# EAGLE design XBee SMT Spring Pin THT Adapter (EAGLE 7.5.0)
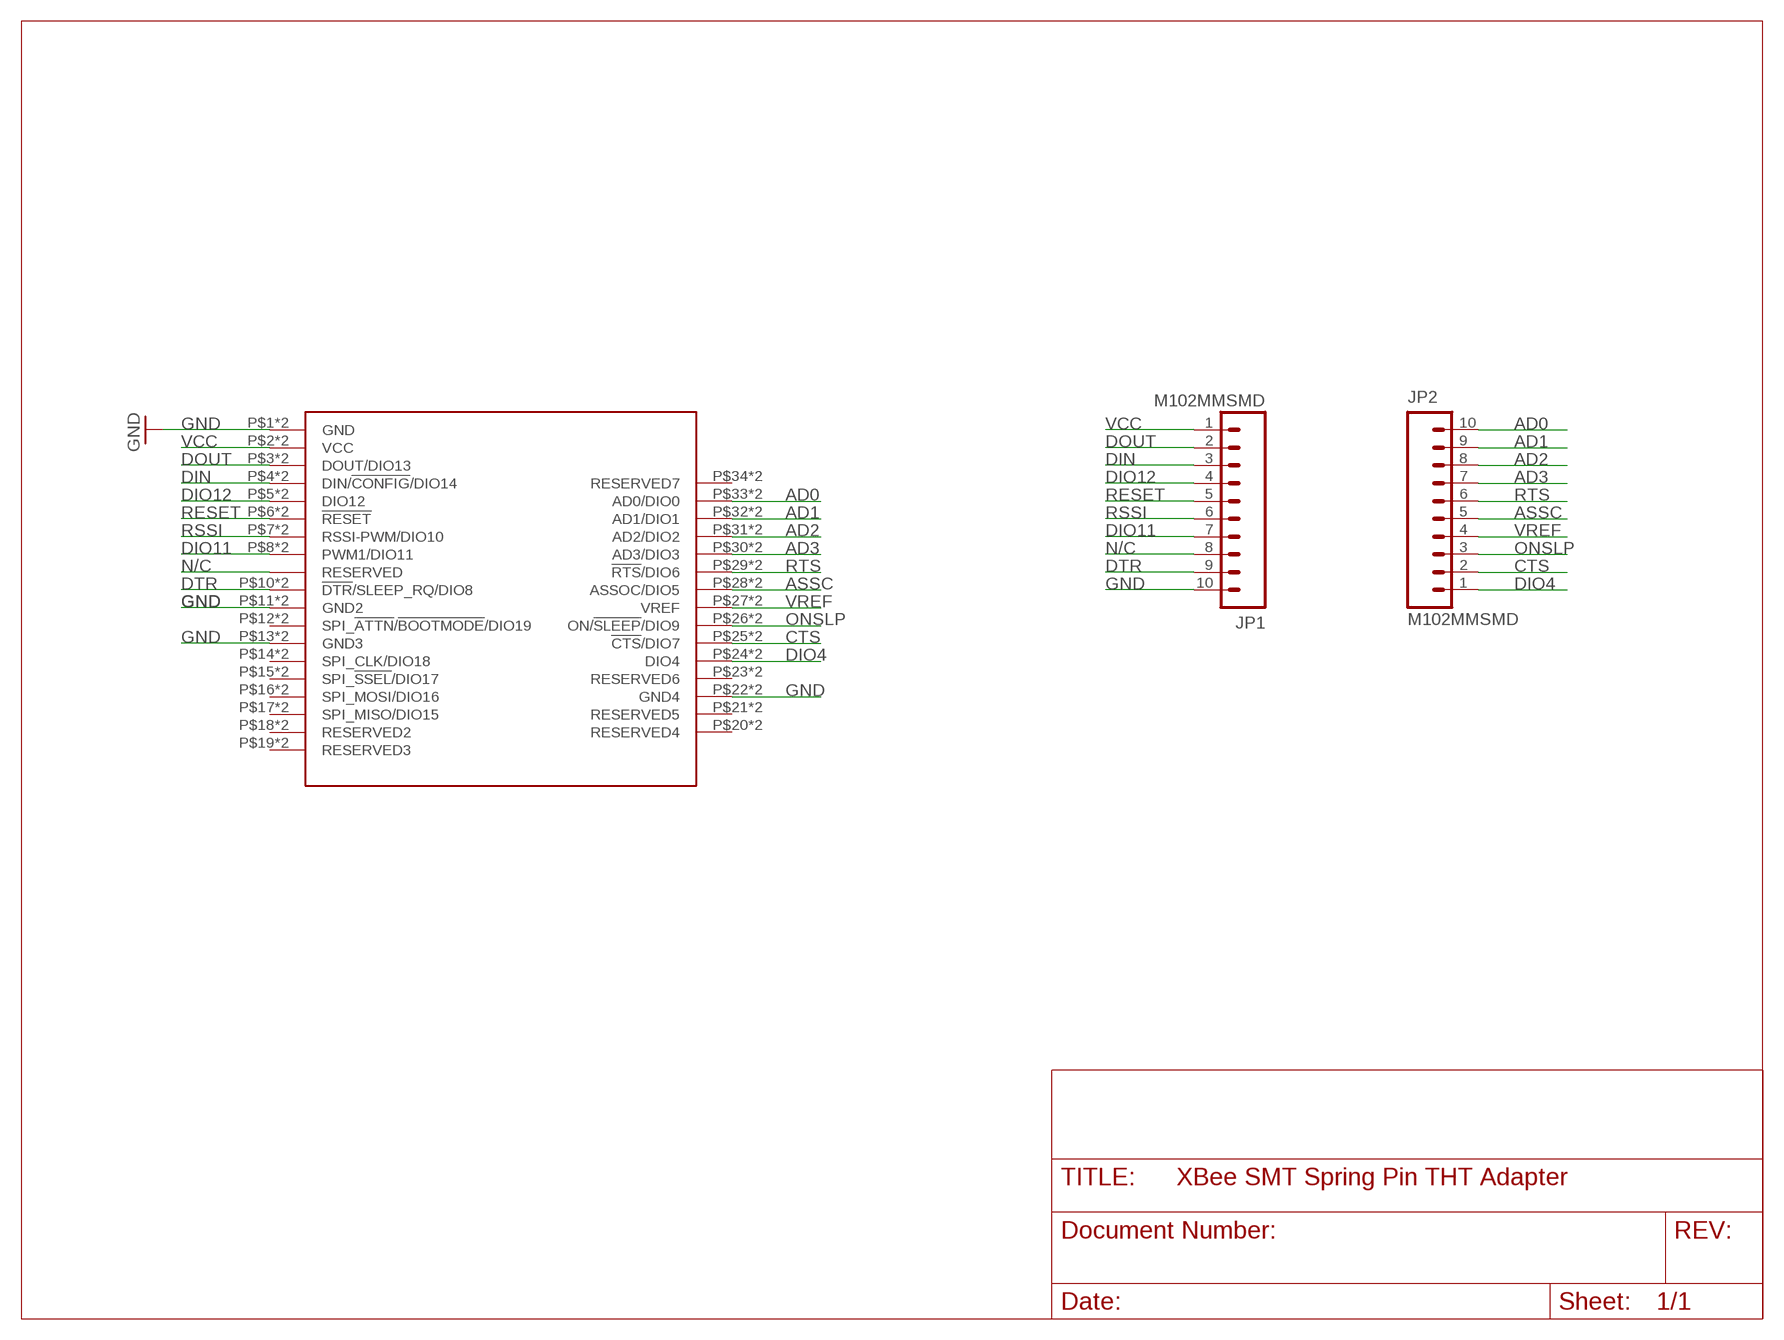
[diagram p0: schematic, sheet 1]

## Parts
JP1  M102MMSMD  [1X10-2MM-SMD]
JP2  M102MMSMD  [1X10-2MM-SMD]
U$2  XBEE-SMT  XBEE_SMT_SPRING_SOCKETSMALL_HOLE  [XBEE_SMT_SPRING_SOCKET_SMALL_HOLE_76002056]

## Nets
AD0: JP2.10 U$2.P$33(AD0/DIO0) U$2.P$330(AD0/DIO0)
AD1: JP2.9 U$2.P$32(AD1/DIO1) U$2.P$320(AD1/DIO1)
AD2: JP2.8 U$2.P$31(AD2/DIO2) U$2.P$310(AD2/DIO2)
AD3: JP2.7 U$2.P$30(AD3/DIO3) U$2.P$300(AD3/DIO3)
ASSC: JP2.5 U$2.P$28(ASSOC/DIO5) U$2.P$280(ASSOC/DIO5)
CTS: JP2.2 U$2.P$25(!CTS!/DIO7) U$2.P$250(!CTS!/DIO7)
DIN: JP1.3 U$2.P$4(DIN/!CONFIG!/DIO14) U$2.P$040(DIN/!CONFIG!/DIO14)
DIO4: JP2.1 U$2.P$24(DIO4) U$2.P$240(DIO4)
DIO11: JP1.7 U$2.P$8(PWM1/DIO11) U$2.P$080(PWM1/DIO11)
DIO12: JP1.4 U$2.P$5(DIO12) U$2.P$050(DIO12)
DOUT: JP1.2 U$2.P$3(DOUT/DIO13) U$2.P$030(DOUT/DIO13)
DTR: JP1.9 U$2.P$10(!DTR!/SLEEP_RQ/DIO8) U$2.P$100(!DTR!/SLEEP_RQ/DIO8)
GND: JP1.10 U$2.P$1(GND) U$2.P$010(GND) U$2.P$11(GND2) U$2.P$13(GND3) U$2.P$22(GND4) U$2.P$110(GND2) U$2.P$130(GND3) U$2.P$220(GND4)
N/C: JP1.8 U$2.P$9(RESERVED) U$2.P$090(RESERVED)
ONSLP: JP2.3 U$2.P$26(ON/!SLEEP!/DIO9) U$2.P$260(ON/!SLEEP!/DIO9)
RESET: JP1.5 U$2.P$6(!RESET) U$2.P$060(!RESET)
RSSI: JP1.6 U$2.P$7(RSSI-PWM/DIO10) U$2.P$070(RSSI-PWM/DIO10)
RTS: JP2.6 U$2.P$29(!RTS!/DIO6) U$2.P$290(!RTS!/DIO6)
VCC: JP1.1 U$2.P$2(VCC) U$2.P$020(VCC)
VREF: JP2.4 U$2.P$27(VREF) U$2.P$270(VREF)
Unconnected: U$2.P$12(SPI_!ATTN!/!BOOTMODE!/DIO19) U$2.P$14(SPI_CLK/DIO18) U$2.P$15(SPI_!SSEL!/DIO17) U$2.P$16(SPI_MOSI/DIO16) U$2.P$17(SPI_MISO/DIO15) U$2.P$18(RESERVED2) U$2.P$19(RESERVED3) U$2.P$20(RESERVED4) U$2.P$21(RESERVED5) U$2.P$23(RESERVED6) U$2.P$34(RESERVED7) U$2.P$120(SPI_!ATTN!/!BOOTMODE!/DIO19) U$2.P$140(SPI_CLK/DIO18) U$2.P$150(SPI_!SSEL!/DIO17) U$2.P$160(SPI_MOSI/DIO16) U$2.P$170(SPI_MISO/DIO15) U$2.P$180(RESERVED2) U$2.P$190(RESERVED3) U$2.P$200(RESERVED4) U$2.P$210(RESERVED5) U$2.P$230(RESERVED6) U$2.P$340(RESERVED7)

## Library data of the parts
JP1 JP2 = SparkFun-Connectors:M10: Header 10 Standard 10-pin 0.1" header. Use with straight break away headers (SKU : PRT-00116), right angle break away headers (PRT-00553), swiss pins (PRT-00743), machine pins (PRT-00117), and female headers (PRT-00115).
U$2 = xbee-smt:XBEE_SMT_SPRING_SOCKET

## Board
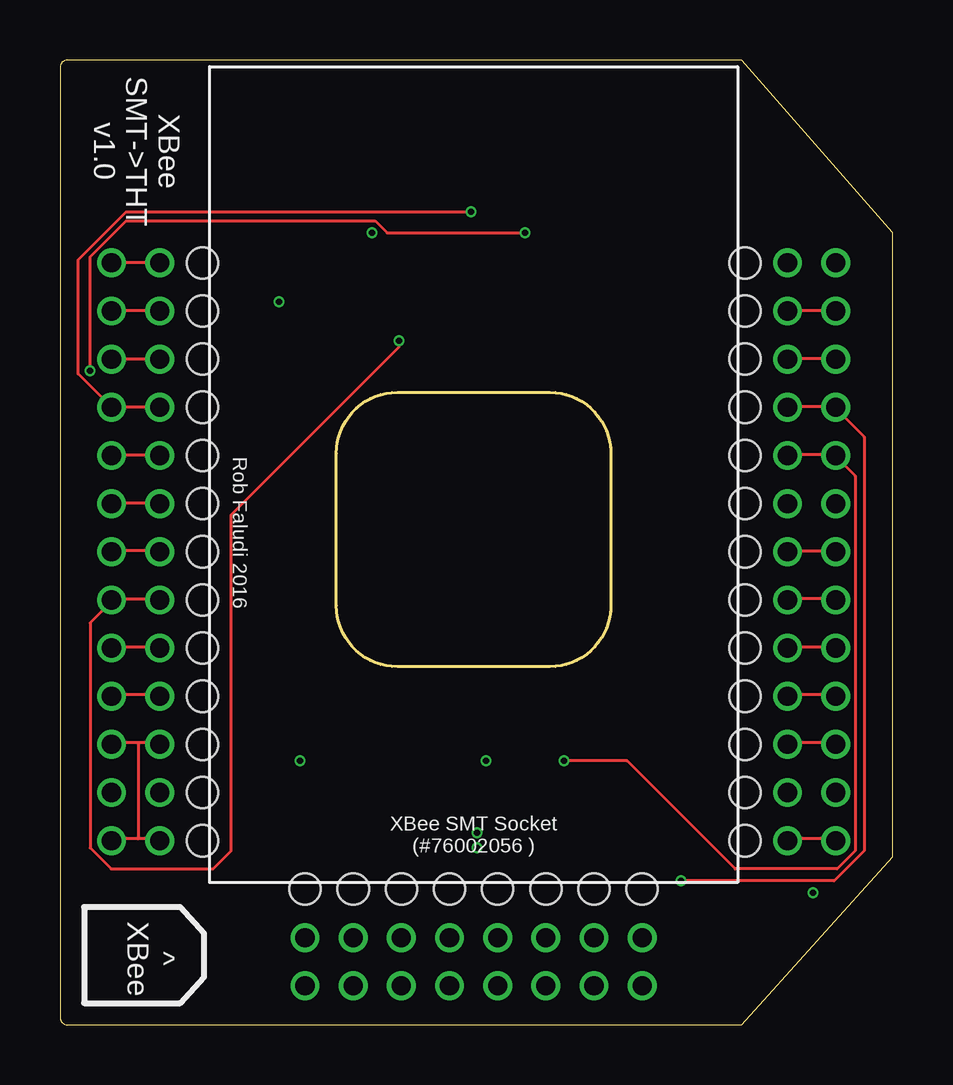
[diagram p1: board, top side]
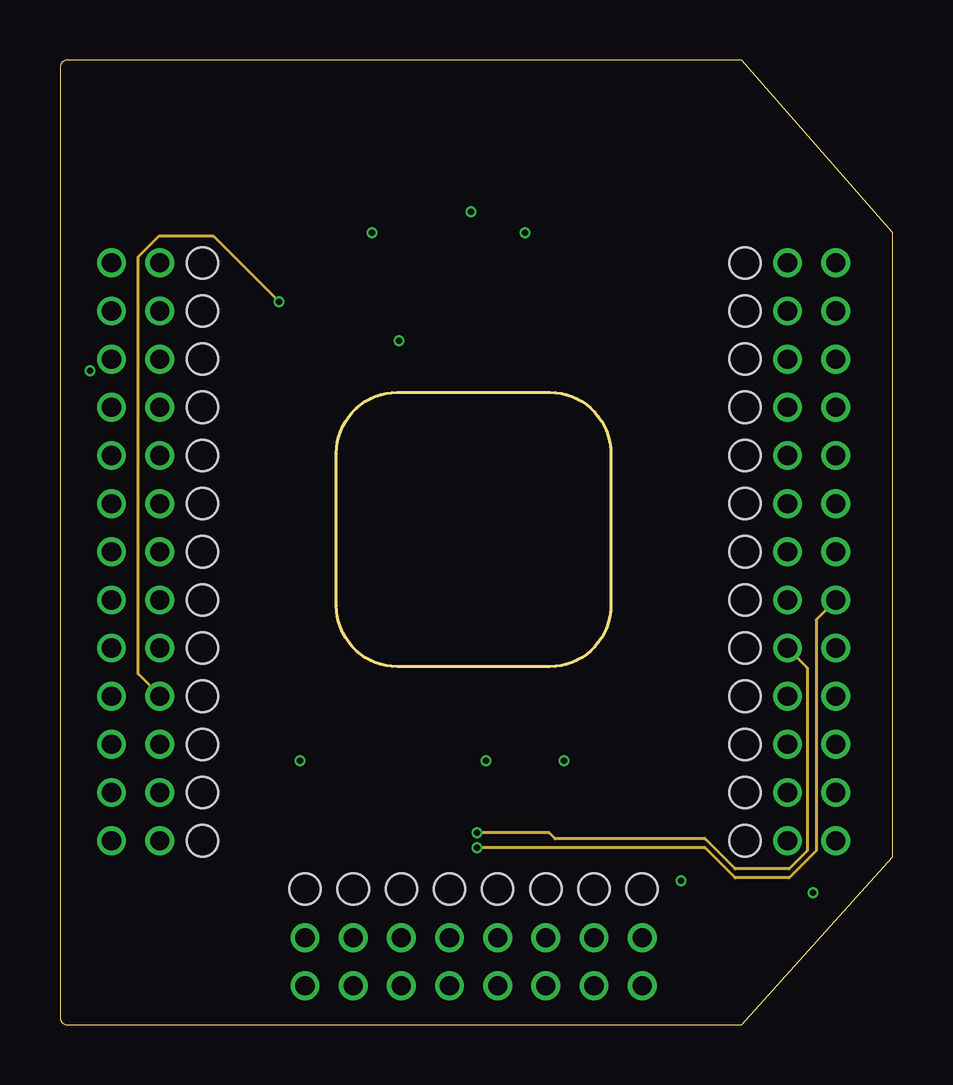
[diagram p2: board, inner layer Route2]
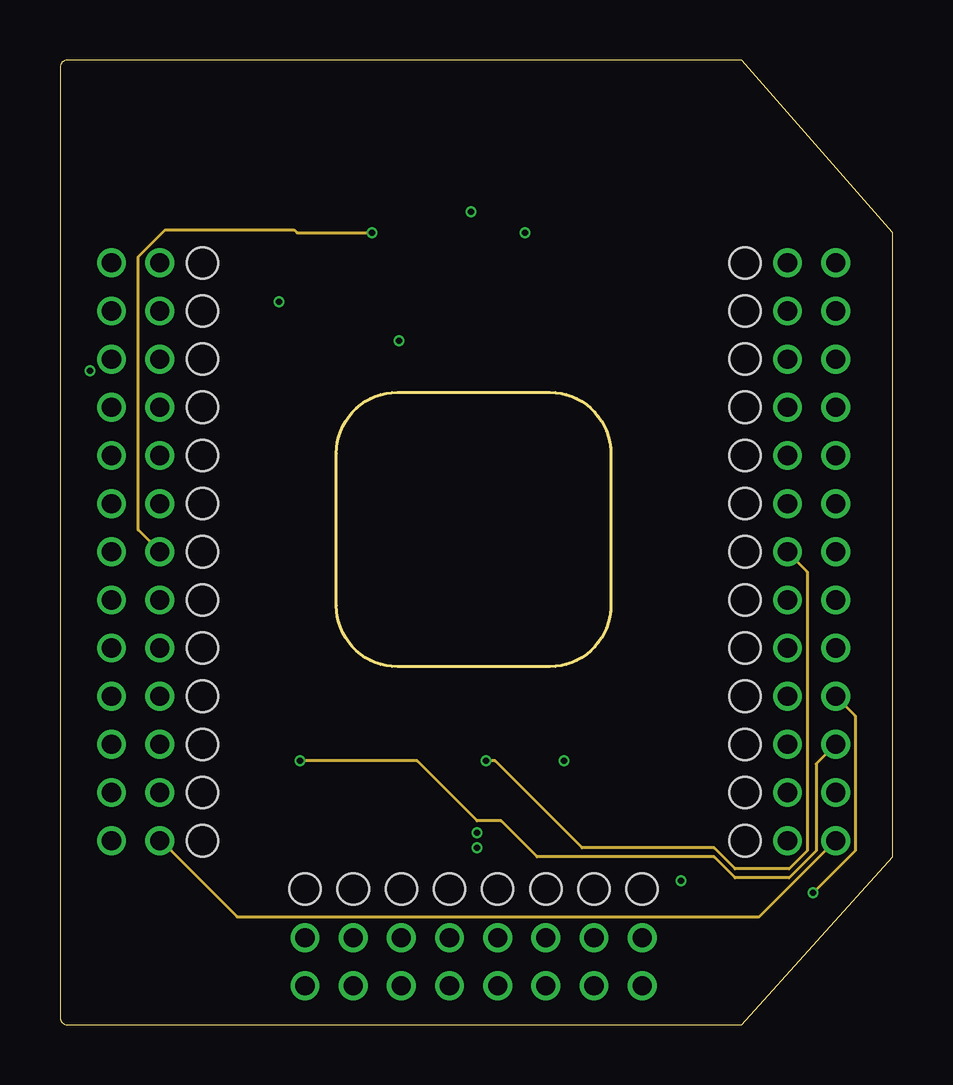
[diagram p3: board, inner layer Route15]
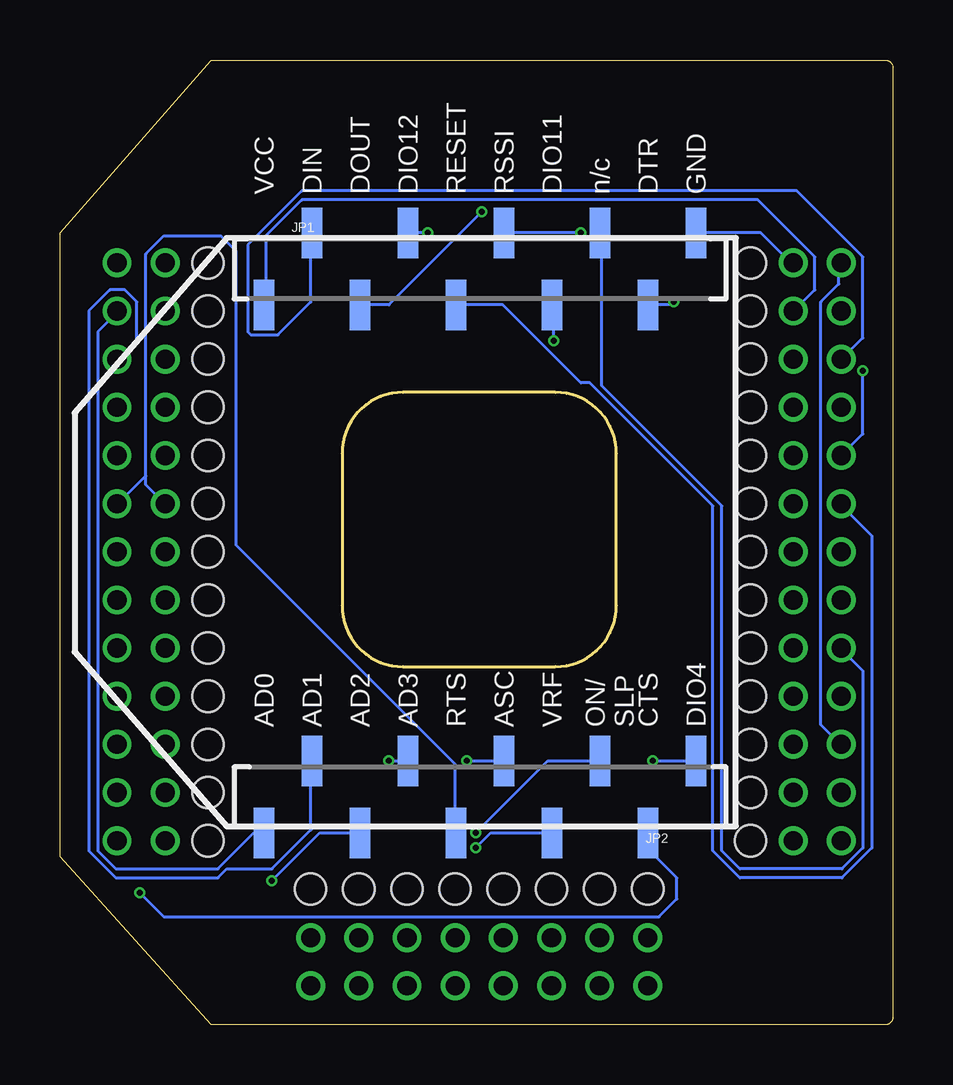
[diagram p4: board, bottom side, seen from below]

Size 34.7 x 40.2 mm. Coordinates in mm from the lower left corner, seen from the top.
Outline: 0,39.88 0,0.32 arc90 0.32,0 28.4,0 34.7,7 34.7,33 28.4,40.2 0.32,40.2 arc90 0,39.88
Copper layers (1*2*15*16): Top 0.035559375mm / dielectric 0.17018125mm / Route2 0.01778125mm / dielectric 47mil / Route15 0.01778125mm / dielectric 0.17018125mm / Bottom 0.035559375mm
Design rules "OSHPark-4layer": minimum track width 5mil, minimum drill 10mil, track to track 5mil, track to pad 5mil, pad to pad 5mil, via to via 5mil, smd to smd 5mil, copper to edge 15mil, drill to drill 6mil, minimum pad ring 4mil, minimum via ring 4mil, stop-mask expansion 2.5mil, vias tented up to drill 0mil, thermal gap 10mil

### Footprints (pad centres in the part's own frame; a part is rotated, then mirrored left to right if it is on the bottom)
1X10-2MM-SMD = smd 0.85 x 2.1: 1 0,-1.5; 2 2,1.5; 3 4,-1.5; 4 6,1.5; 5 8,-1.5; 6 10,1.5; 7 12,-1.5; 8 14,1.5; 9 16,-1.5; 10 18,1.5
XBEE_SMT_SPRING_SOCKET_SMALL_HOLE_76002056 = drill 0.8: P$1 -13.081,9.842; P$2 -13.081,7.836; P$3 -13.081,5.829; P$4 -13.081,3.823; P$5 -13.081,1.816; P$6 -13.081,-0.191; P$7 -13.081,-2.197; P$8 -13.081,-4.204; P$9 -13.081,-6.21; P$010 -15.088,9.842; P$10 -13.081,-8.217; P$11 -13.081,-10.223; P$12 -13.081,-12.23; P$13 -13.081,-14.237; P$14 -7.023,-18.275; P$15 -5.016,-18.275; P$16 -3.01,-18.275; P$17 -1.003,-18.275; P$18 1.003,-18.275; P$19 3.01,-18.275; P$020 -15.088,7.836; P$20 5.016,-18.275; P$21 7.023,-18.275; P$22 13.081,-14.237; P$23 13.081,-12.23; P$24 13.081,-10.223; P$25 13.081,-8.217; P$26 13.081,-6.21; P$27 13.081,-4.204; P$28 13.081,-2.197; P$29 13.081,-0.191; P$30 13.081,1.816; P$030 -15.088,5.829; P$31 13.081,3.823; P$32 13.081,5.829; P$33 13.081,7.836; P$34 13.081,9.842; P$040 -15.088,3.823; P$050 -15.088,1.816; P$060 -15.088,-0.191; P$070 -15.088,-2.197; P$080 -15.088,-4.204; P$090 -15.088,-6.21; P$100 -15.088,-8.217; P$110 -15.088,-10.223; P$120 -15.088,-12.23; P$130 -15.088,-14.237; P$140 -7.023,-20.282; P$150 -5.016,-20.282; P$160 -3.01,-20.282; P$170 -1.003,-20.282; P$180 1.003,-20.282; P$190 3.01,-20.282; P$200 5.016,-20.282; P$210 7.023,-20.282; P$220 15.088,-14.237; P$230 15.088,-12.23; P$240 15.088,-10.223; P$250 15.088,-8.217; P$260 15.088,-6.21; P$270 15.088,-4.204; P$280 15.088,-2.197; P$290 15.088,-0.191; P$300 15.088,1.816; P$310 15.088,3.823; P$320 15.088,5.829; P$330 15.088,7.836; P$340 15.088,9.842 | hole 1.3: 11.303,9.842; 11.303,7.836; 11.303,5.829; 11.303,3.823; 11.303,1.816; 11.303,-0.191; 11.303,-2.197; 11.303,-4.204; 11.303,-6.21; 11.303,-8.217; 11.303,-10.223; 11.303,-12.23; 11.303,-14.237; -11.303,9.842; -11.303,7.836; -11.303,5.829; -11.303,3.823; -11.303,1.816; -11.303,-0.191; -11.303,-2.197; -11.303,-4.204; -11.303,-6.21; -11.303,-8.217; -11.303,-10.223; -11.303,-12.23; -11.303,-14.237; 7.023,-16.243; 5.016,-16.243; 3.01,-16.243; 1.003,-16.243; -1.003,-16.243; -3.01,-16.243; -5.016,-16.243; -7.023,-16.243

### Placement (x,y rotation side)
JP1  26.2,31.5 0 bottom
JP2  8.2,9.5 180 bottom
U$2  17.23,21.91 0 top

### Tracks (layer width: path | path; a pad name or v marks a point on that pad's centre or on a via)
AD0
  Top 0.127: U$2.P$33 30.38,29.75 32.25,29.75 U$2.P$330
  Bottom 0.127: JP2.10 26.62,8 28.12,6.5 32.38,6.5 33.12,7.25 33.12,28.88 32.38,29.62 U$2.P$330
AD1
  Top 0.127: U$2.P$32 30.38,27.75 32.25,27.75 U$2.P$320
  Bottom 0.127: JP2.9 24.25,11 24.25,8.12 25.88,6.5 27.75,6.5 28.12,6.12 32.38,6.12 33.5,7.25 33.5,29.75 32.62,30.62 32,30.62 31.5,30.12 31.5,28.5 32.25,27.75 U$2.P$320
AD2  (via drill 0.25)
  Top 0.127: v25.88,6 32.25,6 33.5,7.25 33.5,24.5 32.38,25.62 U$2.P$310 32.25,25.75 30.38,25.75 U$2.P$31
  Bottom 0.127: JP2.8 23.88,8 v25.88,6
AD3  (via drill 0.25)
  Top 0.127: v21,11 23.62,11 28.12,6.5 32.38,6.5 33.12,7.25 33.12,22.88 32.38,23.62 U$2.P$300 32.25,23.75 30.38,23.75 U$2.P$30
  Bottom 0.127: v21,11 JP2.7
ASSC  (via drill 0.25)
  Top 0.127: U$2.P$280 32.25,19.75 30.38,19.75 U$2.P$28
  Route15 0.127: v17.75,11 18.12,11 21.75,7.38 27.25,7.38 28.12,6.5 30.38,6.5 31.12,7.25 31.12,18.88 30.38,19.62 U$2.P$28
  Bottom 0.127: v17.75,11 JP2.5
CTS  (via drill 0.25)
  Top 0.127: U$2.P$25 30.38,13.75 32.25,13.75 U$2.P$250
  Route15 0.127: v31.38,5.5 33.12,7.25 33.12,12.88 32.38,13.62 U$2.P$250
  Bottom 0.127: v31.38,5.5 30.38,4.5 9.75,4.5 9,5.25 9,6.12 10.12,7.25 10.12,8 JP2.2
DIN  (via drill 0.25)
  Top 0.127: v17.12,33.88 2.75,33.88 0.75,31.88 0.75,27.12 2.12,25.75 U$2.P$040 2.25,25.75 4.12,25.75 U$2.P$4
  Bottom 0.127: JP1.3 21,30 v17.12,33.88
DIO4  (via drill 0.25)
  Top 0.127: U$2.P$24 30.38,11.75 32.25,11.75 U$2.P$240
  Route15 0.127: v10,11 14.88,11 17.38,8.5 18.38,8.5 19.88,7 27.25,7 28.12,6.12 30.38,6.12 31.5,7.25 31.5,10.88 32.25,11.62 U$2.P$240
  Bottom 0.127: v10,11 JP2.1
DIO11  (via drill 0.25)
  Top 0.127: v14.12,28.5 14.12,28.25 7.12,21.25 7.12,7.25 6.38,6.5 2.12,6.5 1.25,7.38 1.25,16.75 2.12,17.62 U$2.P$080 2.25,17.75 4.12,17.75 U$2.P$8
  Bottom 0.127: v14.12,28.5 14.12,30 JP1.7
DIO12  (via drill 0.25)
  Top 0.127: v19.38,33 13.62,33 13.12,33.5 2.75,33.5 1.25,32 v1.25,27.25 | U$2.P$5 4.12,23.75 2.25,23.75 U$2.P$050
  Bottom 0.127: v19.38,33 JP1.4 | v1.25,27.25 1.25,24.62 2.12,23.75 U$2.P$050
DOUT
  Top 0.127: U$2.P$3 4.12,27.75 2.25,27.75 U$2.P$030
  Bottom 0.127: JP1.2 24.25,33 24.25,30.12 25.62,28.75 26.75,28.75 26.88,28.88 26.88,32.5 24.62,34.75 4,34.75 1.25,32 1.25,28.62 2.12,27.75 U$2.P$030
DTR  (via drill 0.25)
  Top 0.127: U$2.P$100 2.25,13.75 4.12,13.75 U$2.P$10
  Route2 0.127: v9.12,30.12 6.38,32.88 4.12,32.88 3.25,32 3.25,14.62 4.12,13.75 U$2.P$10
  Bottom 0.127: JP1.9 9.25,30 v9.12,30.12
GND
  Top 0.127: U$2.P$010 2.25,31.75 4.12,31.75 U$2.P$1 | U$2.P$22 30.38,7.75 32.25,7.75 U$2.P$220 | 3.25,7.75 4.12,7.75 U$2.P$13 | 3.25,7.75 2.25,7.75 U$2.P$130 | 3.25,11.75 4.12,11.75 U$2.P$11 | 3.25,11.75 2.25,11.75 U$2.P$110 | 3.25,11.75 3.25,7.75
  Route15 0.127: U$2.P$220 32.25,7.62 29.12,4.5 7.38,4.5 4.25,7.62 U$2.P$13
  Bottom 0.127: JP1.10 5.5,33 4.25,31.75 U$2.P$1 | U$2.P$010 2.25,31.62 2.25,30.88 3,30.12 3,12.5 2.25,11.75 U$2.P$110
N/C
  Top 0.127: U$2.P$9 4.12,15.75 2.25,15.75 U$2.P$090
  Bottom 0.127: JP1.8 12.12,33 12.12,26.62 7.12,21.62 7.12,7.25 6.38,6.5 2.12,6.5 1.25,7.38 1.25,14.75 2.12,15.62 U$2.P$090
ONSLP  (via drill 0.25)
  Top 0.127: U$2.P$260 32.25,15.75 30.38,15.75 U$2.P$26
  Route2 0.127: v17.38,8 20.38,8 20.62,7.75 26.88,7.75 28.12,6.5 30.38,6.5 31.12,7.25 31.12,14.88 30.38,15.62 U$2.P$26
  Bottom 0.127: JP2.3 14.38,11 v17.38,8
RESET
  Top 0.127: U$2.P$6 4.12,21.75 2.25,21.75 U$2.P$060
  Bottom 0.127: JP1.5 16.25,30 13,26.75 12.62,26.75 7.5,21.62 7.5,7.25 6.38,6.12 2.12,6.12 0.88,7.38 0.88,20.38 2.12,21.62 U$2.P$060
RSSI  (via drill 0.25)
  Top 0.127: U$2.P$070 2.25,19.75 4.12,19.75 U$2.P$7
  Route15 0.127: v13,33 9.88,33 9.75,33.12 4.38,33.12 3.25,32 3.25,20.62 4.12,19.75 U$2.P$7
  Bottom 0.127: v13,33 JP1.6
RTS
  Bottom 0.127: 31.12,22.88 31.12,22.5 30.38,21.75 U$2.P$29 | 31.12,22.88 31.12,32.12 30.38,32.88 28,32.88 27.38,32.25 27.38,20 18.25,10.88 18.25,8 JP2.6 | 31.12,22.88 32.25,21.75 U$2.P$290
VCC
  Top 0.127: U$2.P$020 2.25,29.75 4.12,29.75 U$2.P$2
  Bottom 0.127: JP1.1 26.12,30 26.12,32.88 24.62,34.38 5.62,34.38 3.25,32 3.25,30.62 4.12,29.75 U$2.P$2
VREF  (via drill 0.25)
  Top 0.127: U$2.P$27 30.38,17.75 32.25,17.75 U$2.P$270
  Route2 0.127: v17.38,7.38 26.88,7.38 28.12,6.12 30.38,6.12 31.5,7.25 31.5,16.88 32.25,17.62 U$2.P$270
  Bottom 0.127: JP2.4 16.75,8 v17.38,7.38

### Text on the board
tNames: XBee / SMT->THT / v1.0 | Rob Faludi 2016 | ^ / XBee
bNames: GND | DTR | n/c | DIO11 | RSSI | RESET | DIO12 | DOUT | DIN | VCC | DIO4 | CTS | ON/ / SLP | VRF | ASC | RTS | AD3 | AD2 | AD1 | AD0